# EAGLE design controllerBox (EAGLE 6.6.0)
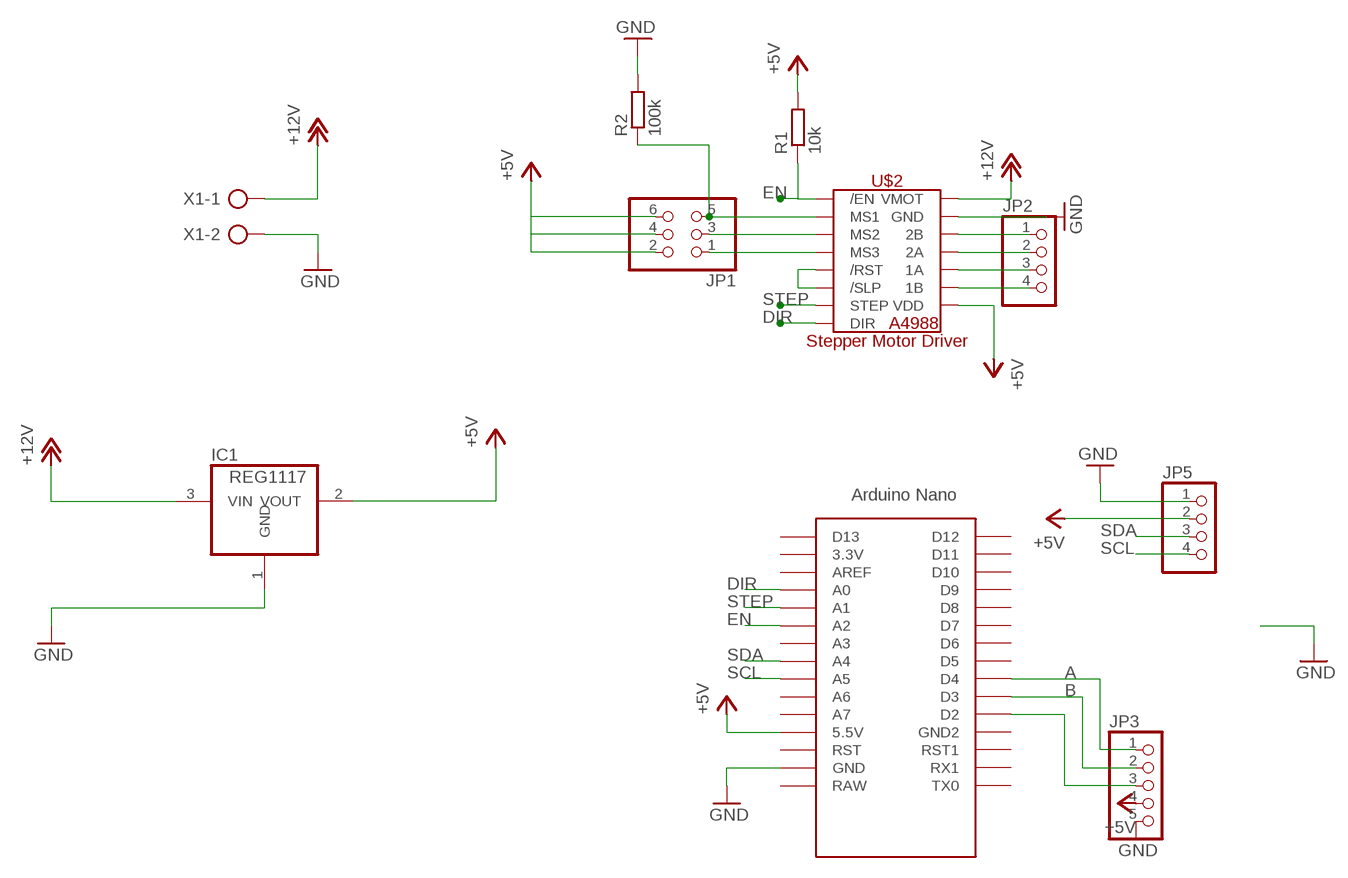
[diagram p0: schematic, sheet 1]

## Parts
IC1  REG1117  [SOT223]
JP1  PINHD-2X3  [2X03]
JP2  PINHD-1X4  [1X04]
JP3  PINHD-1X5  [1X05]
JP5  PINHD-1X4  [1X04]
R1  10k  R-EU_0207/10  [0207/10]
R2  100k  R-EU_0207/10  [0207/10]
U$1  NANO  [NANO]
U$2  A4988_STEP  [A4988_STEP]
X1  AK300/2  [AK300/2]

## Nets
+5V: IC1.2(VOUT) JP1.2 JP1.4 JP1.6 JP3.4 JP5.2 R1.2 U$1.5V(5.5V) U$2.VDD
+12V: IC1.3(VIN) U$2.VMOT X1.1
A: JP3.1 U$1.D4
B: JP3.2 U$1.D3
DIR: U$1.A0 U$2.DIR
EN: R1.1 U$1.A2 U$2./EN
GND: IC1.1(GND) JP3.5 JP5.1 R2.2 U$1.GND U$2.GND U$2.GND2(GND) X1.2
N$1: U$2./RST U$2./SLP
N$2: JP1.5 R2.1 U$2.MS1
N$3: JP1.3 U$2.MS2
N$4: JP1.1 U$2.MS3
N$5: JP2.1 U$2.2B
N$6: JP2.2 U$2.2A
N$7: JP2.3 U$2.1A
N$8: JP2.4 U$2.1B
N$9: JP3.3 U$1.D2
SCL: JP5.4 U$1.A5
SDA: JP5.3 U$1.A4
STEP: U$1.A1 U$2.STEP
Unconnected: U$1.3.3V U$1.A3 U$1.A6 U$1.A7 U$1.AREF U$1.D5 U$1.D6 U$1.D7 U$1.D8 U$1.D9 U$1.D10 U$1.D11 U$1.D12 U$1.D13 U$1.GND1(GND2) U$1.ICSP1 U$1.ICSP2 U$1.ICSP3 U$1.ICSP4 U$1.ICSP5 U$1.ICSP6 U$1.RAW U$1.RST U$1.RST1 U$1.RX1 U$1.TX0

## Library data of the parts
IC1 = burr-brown:REG1117: 800mA and 1A Low Dropout (LDO) Positive Regulator 1.8V, 2.5V, 2.85V, 3.3V, 5V, and Adj; MPN: REG1117; OC_FARNELL: 1097566; OC_NEWARK: 14P6981
JP1 = pinhead:PINHD-2X3: PIN HEADER
JP2 JP5 = pinhead:PINHD-1X4: PIN HEADER
JP3 = pinhead:PINHD-1X5: PIN HEADER
R1 R2 = rcl:R-EU_: RESISTOR, European symbol
U$1 = Arduino-clone:NANO: Arduino Nano
U$2 = ic:A4988_STEP
X1 = con-ptr500:AK300/2: CONNECTOR; OC_FARNELL: unknown; OC_NEWARK: unknown

## Board
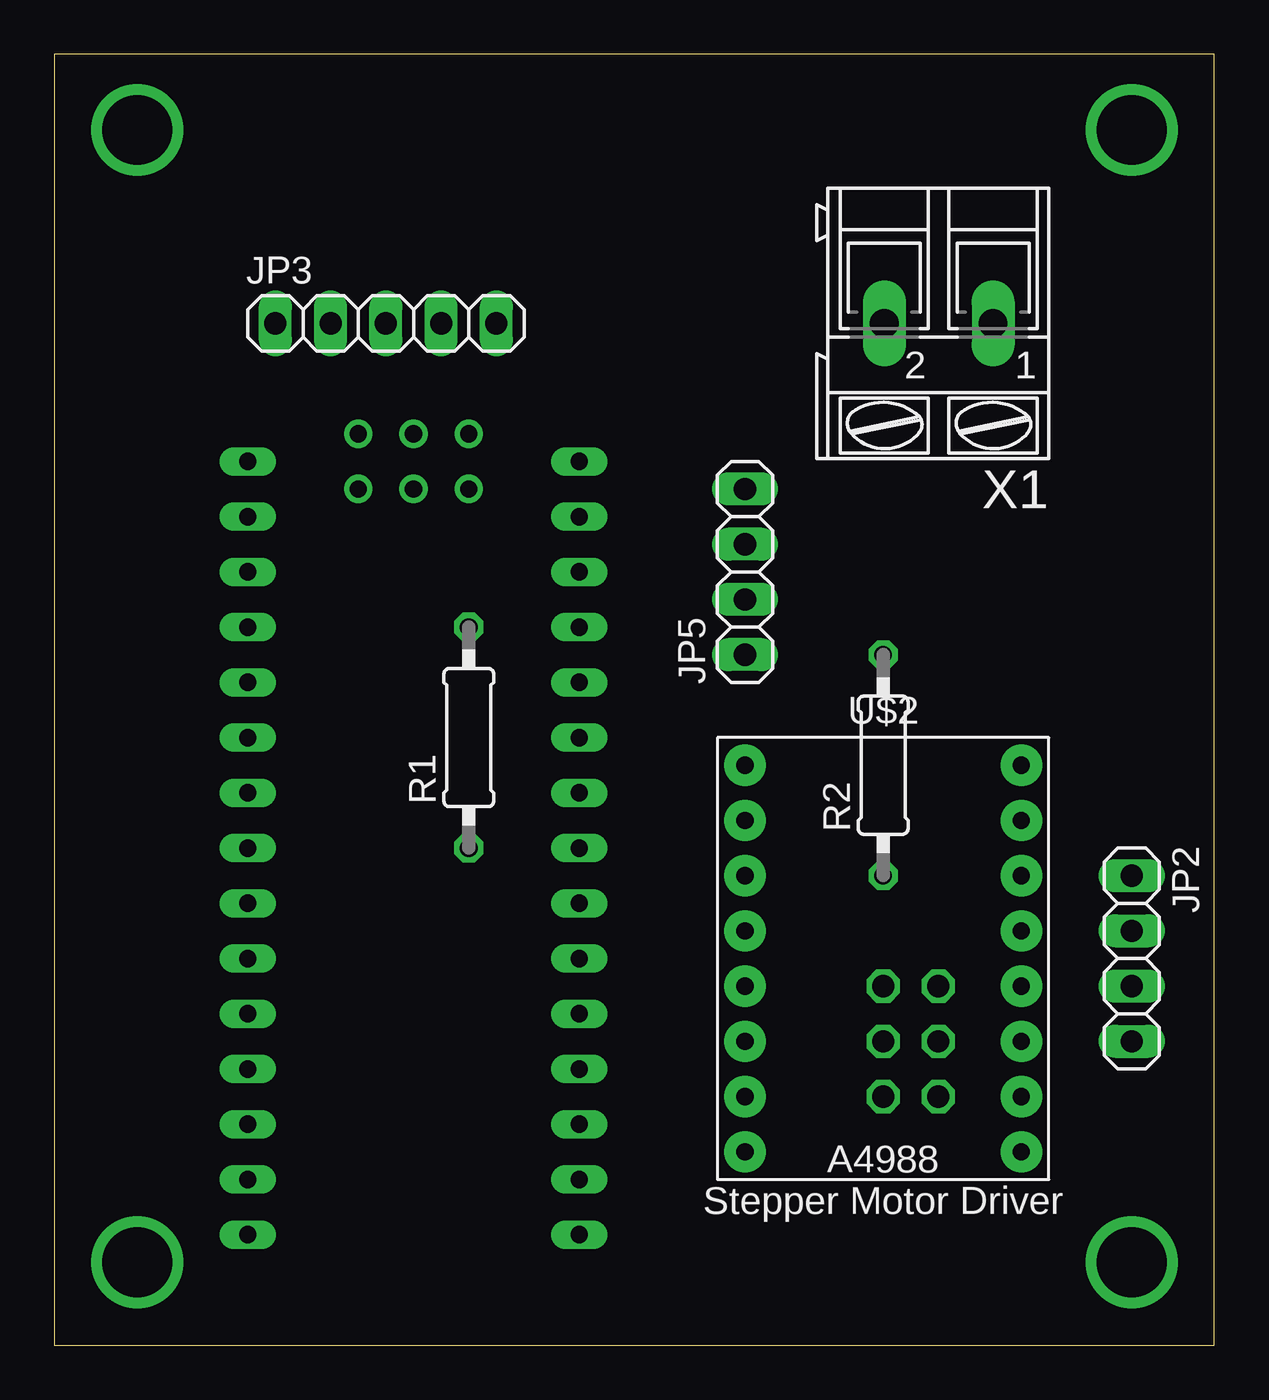
[diagram p1: board, top side]
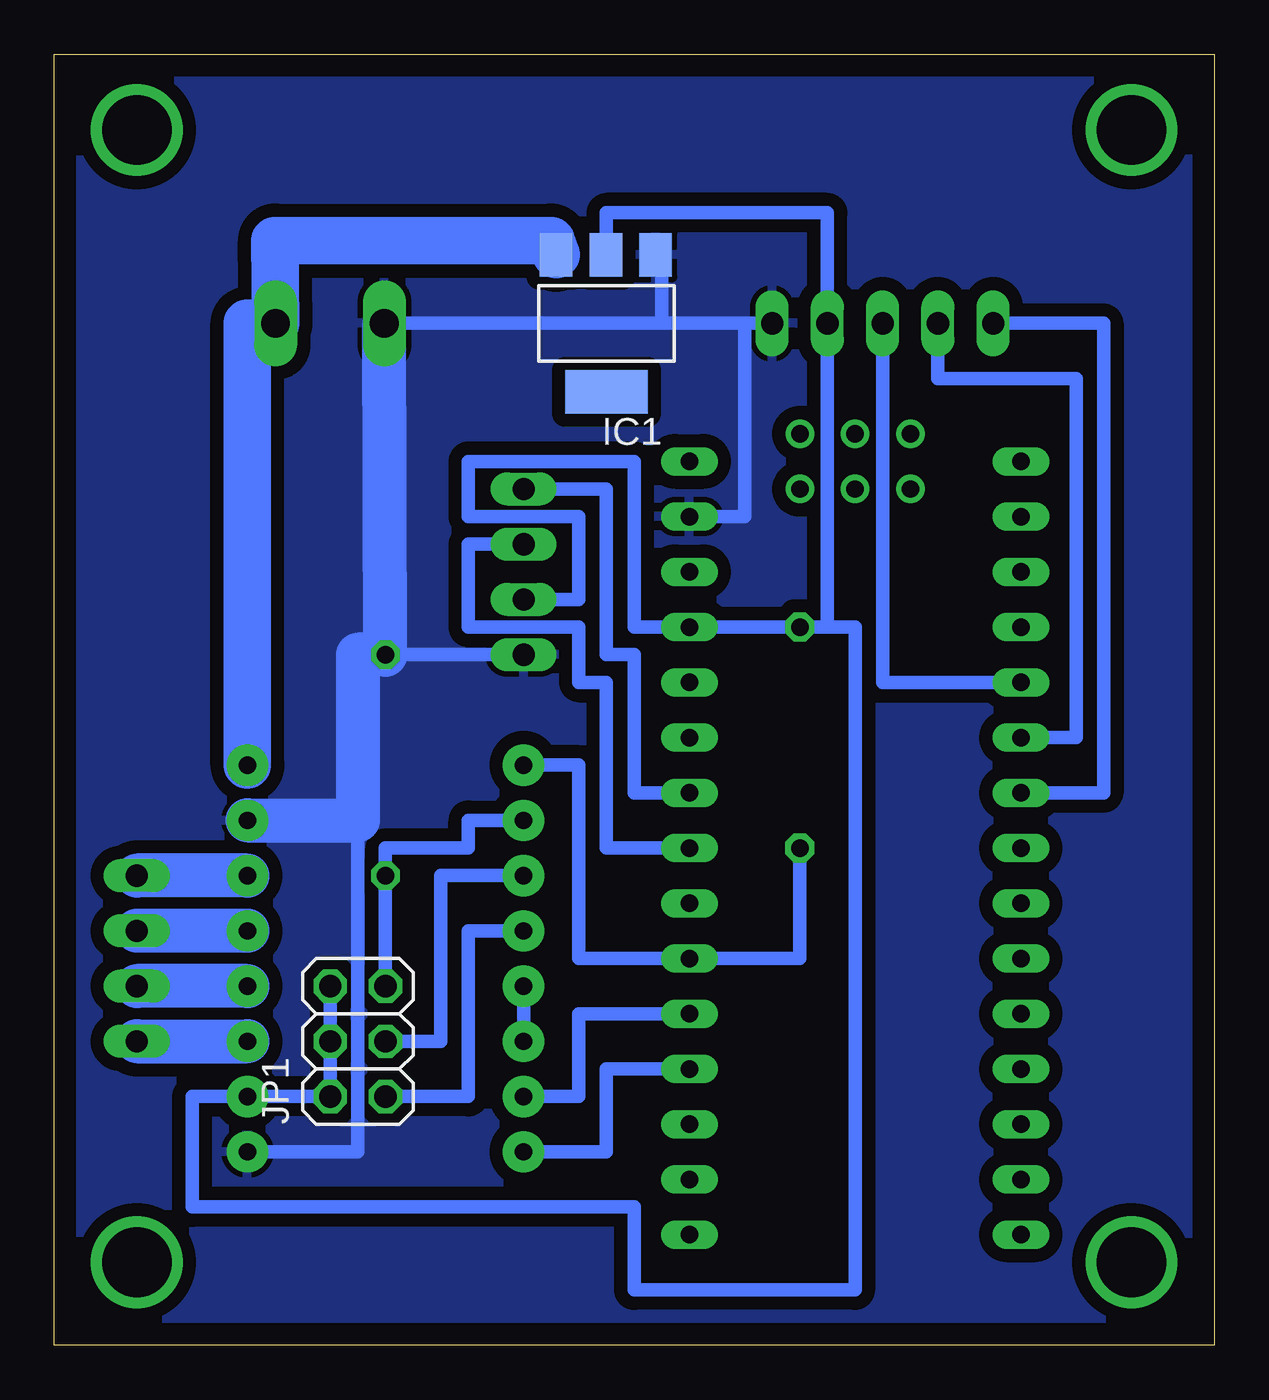
[diagram p2: board, bottom side, seen from below]

Size 53.32 x 59.36 mm. Coordinates in mm from the lower left corner, seen from the top.
Outline: 0,0 53.32,0 53.32,59.36 0,59.36 0,0
Copper layers (1*16): Top 0.035mm / dielectric 1.5mm / Bottom 0.035mm
Design rules "default *": minimum track width 24mil, minimum drill 24mil, track to track 8mil, track to pad 8mil, pad to pad 8mil, via to via 8mil, smd to smd 8mil, copper to edge 40mil, drill to drill 8mil, minimum pad ring 10mil, minimum via ring 8mil, stop-mask expansion 4mil, vias tented up to drill 0mil, thermal gap 10mil

### Footprints (pad centres in the part's own frame; a part is rotated, then mirrored left to right if it is on the bottom)
SOT223 = smd 1.499 x 2.007: 1 -2.261,-3.15; 2 0.025,-3.15; 3 2.311,-3.15 | smd 3.81 x 2.007: 4 0,3.15
2X03 = drill 1.016 octagon: 1 -2.54,-1.27; 2 -2.54,1.27; 3 0,-1.27; 4 0,1.27; 5 2.54,-1.27; 6 2.54,1.27
1X04 = drill 1.016 long: 1 -3.81,0; 2 -1.27,0; 3 1.27,0; 4 3.81,0
1X05 = drill 1.016 long: 1 -5.08,0; 2 -2.54,0; 3 0,0; 4 2.54,0; 5 5.08,0
0207/10 = drill 0.813 octagon: 1 -5.08,0; 2 5.08,0
NANO = drill 0.8 long: 3.3V -10.16,24.13; 5V -10.16,-1.27; A0 -10.16,19.05; A1 -10.16,16.51; A2 -10.16,13.97; A3 -10.16,11.43; A4 -10.16,8.89; A5 -10.16,6.35; A6 -10.16,3.81; A7 -10.16,1.27; AREF -10.16,21.59; D2 5.08,1.27; D3 5.08,3.81; D4 5.08,6.35; D5 5.08,8.89; D6 5.08,11.43; D7 5.08,13.97; D8 5.08,16.51; D9 5.08,19.05; D10 5.08,21.59; D11 5.08,24.13; D12 5.08,26.67; D13 -10.16,26.67; GND -10.16,-6.35; GND1 5.08,-1.27; RAW -10.16,-8.89; RST -10.16,-3.81; RST1 5.08,-3.81; RX1 5.08,-6.35; TX0 5.08,-8.89 | drill 0.8: ICSP1 -5.08,-10.16; ICSP2 -5.08,-7.62; ICSP3 -2.54,-10.16; ICSP4 -2.54,-7.62; ICSP5 0,-10.16; ICSP6 0,-7.62
A4988_STEP = drill 0.8 pad 1.905: 1A 6.35,-1.27; 1B 6.35,-3.81; 2A 6.35,1.27; 2B 6.35,3.81; /EN -6.35,8.89; /RST -6.35,-1.27; /SLP -6.35,-3.81; DIR -6.35,-8.89; GND 6.35,6.35; GND2 6.35,-8.89; MS1 -6.35,6.35; MS2 -6.35,3.81; MS3 -6.35,1.27; STEP -6.35,-6.35; VDD 6.35,-6.35; VMOT 6.35,8.89
AK300/2 = drill 1.321 long: 1 -2.515,0; 2 2.489,0

### Placement (x,y rotation side)
IC1  27.94,46.99 180 bottom
JP1  39.37,13.97 90 bottom
JP2  49.53,17.78 270 top
JP3  15.24,46.99 0 top
JP5  31.75,35.56 90 top
R1  19.05,27.94 90 top
R2  38.1,26.67 90 top
U$1  13.97,31.75 180 top
U$2  38.1,17.78 0 top
X1  40.64,46.99 180 top

### Tracks (layer width: path | path; a pad name or v marks a point on that pad's centre or on a via)
+5V
  Bottom 0.61: IC1.2 27.94,50.8 27.94,52.07 17.78,52.07 JP3.4 17.78,33.02 R1.2 | JP1.6 JP1.4 JP1.2 U$2.VDD 46.99,11.43 46.99,6.35 26.67,6.35 26.67,2.54 16.51,2.54 16.51,33.02 R1.2 | R1.2 U$1.5V 26.67,33.02 26.67,40.64 34.29,40.64 34.29,38.1 29.21,38.1 29.21,34.29 JP5.2
+12V
  Bottom 2.184: IC1.3 30.48,50.8 43.18,50.8 X1.1 44.45,46.99 U$2.VMOT
A
  Bottom 0.61: U$1.D4 5.08,25.4 5.08,29.21 5.08,46.99 JP3.1
B
  Bottom 0.61: U$1.D3 6.35,27.94 6.35,30.48 6.35,44.45 11.43,44.45 12.7,44.45 12.7,45.72 JP3.2
DIR
  Bottom 0.61: U$1.A0 27.94,12.7 27.94,8.89 U$2.DIR
EN
  Bottom 0.61: R1.1 19.05,17.78 U$1.A2 29.21,17.78 29.21,26.67 U$2./EN
GND
  Bottom 0.61: 25.4,46.99 25.4,49.53 IC1.1 | JP3.5 21.59,46.99 | 21.59,46.99 25.4,46.99 | U$1.GND 21.59,38.1 21.59,46.99 | 25.4,46.99 X1.2 | U$2.GND2 39.37,8.89 39.37,24.13 | JP5.1 R2.2
  Bottom 2.032: U$2.GND 39.37,24.13 39.37,31.75 R2.2 X1.2
  pour Bottom (isolate 0.61): 0,59.69 53.34,59.69 53.34,0 0,0
N$1
  Bottom 0.61: U$2./RST U$2./SLP
N$2
  Bottom 0.61: JP1.5 R2.1 38.1,22.86 34.29,22.86 34.29,24.13 U$2.MS1
N$3
  Bottom 0.61: JP1.3 35.56,13.97 35.56,21.59 U$2.MS2
N$4
  Bottom 0.61: JP1.1 34.29,11.43 34.29,15.24 34.29,19.05 U$2.MS3
N$5
  Bottom 2.032: U$2.2B JP2.1
N$6
  Bottom 2.032: U$2.2A JP2.2
N$7
  Bottom 2.032: U$2.1A JP2.3
N$8
  Bottom 2.032: JP2.4 U$2.1B
N$9
  Bottom 0.61: U$1.D2 15.24,30.48 15.24,36.83 JP3.3
N$10  (via drill 3.2)
  other vias: 3.81,55.88
N$11  (via drill 3.2)
  other vias: 49.53,55.88
N$12  (via drill 3.2)
  other vias: 49.53,3.81
N$13  (via drill 3.2)
  other vias: 3.81,3.81
SCL
  Bottom 0.61: U$1.A5 26.67,25.4 26.67,31.75 27.94,31.75 27.94,39.37 JP5.4
SDA
  Bottom 0.61: U$1.A4 27.94,22.86 27.94,30.48 29.21,30.48 29.21,33.02 34.29,33.02 34.29,36.83 JP5.3
STEP
  Bottom 0.61: U$1.A1 25.4,15.24 29.21,15.24 29.21,11.43 U$2.STEP